# EAGLE schematic supervisor (EAGLE 8.0.0)
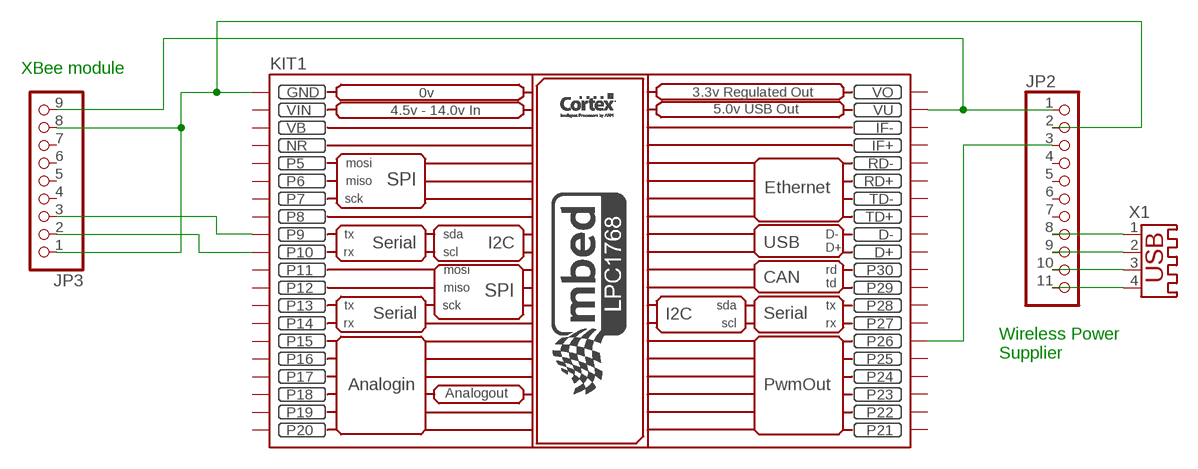
[diagram p0: schematic, sheet 1]

## Parts
JP2  PINHD-1X11  [1X11]
JP3  PINHD-1X9  [1X09]
KIT1  MBED_NXP_LPC1768  [MBED-KIT]
X1  USB-A003  [USB-A003]

## Nets
N$1: JP2.1 JP3.9 KIT1.VU
N$2: JP2.2 JP3.1 JP3.8 KIT1.GND
N$3: JP3.2 KIT1.P$10(P10)
N$4: JP3.3 KIT1.P$9(P9)
N$5: JP2.3 KIT1.P$26(P26)
N$6: JP2.8 X1.1
N$7: JP2.9 X1.2
N$8: JP2.10 X1.3
N$9: JP2.11 X1.4
Unconnected: JP2.4 JP2.5 JP2.6 JP2.7 JP3.4 JP3.5 JP3.6 JP3.7 KIT1.D+ KIT1.D- KIT1.IF+ KIT1.IF- KIT1.P$5(P5) KIT1.P$6(P6) KIT1.P$7(P7) KIT1.P$8(P8) KIT1.P$11(P11) KIT1.P$12(P12) KIT1.P$13(P13) KIT1.P$14(P14) KIT1.P$15(P15) KIT1.P$16(P16) KIT1.P$17(P17) KIT1.P$18(P18) KIT1.P$19(P19) KIT1.P$20(P20) KIT1.P$21(P21) KIT1.P$22(P22) KIT1.P$23(P23) KIT1.P$24(P24) KIT1.P$25(P25) KIT1.P$27(P27) KIT1.P$28(P28) KIT1.P$29(P29) KIT1.P$30(P30) KIT1.RD+ KIT1.RD- KIT1.TD+ KIT1.TD-

## Notes on the sheet
- XBee module
- Wireless Power
  Supplier

## Power pins joined to a net without a drawn wire
NR: KIT1.NR
VB: KIT1.VB
VIN: KIT1.VIN
VO: KIT1.VOUT(VO)

## Library data of the parts
JP2 = pinhead:PINHD-1X11: PIN HEADER
JP3 = pinhead:PINHD-1X9: PIN HEADER
KIT1 = MBED_v2.1:MBED_NXP_LPC1768: Mbed LPC1768 - ARM CORTEX v2.1 * Schematic symbol is now placed in eagles's default raster. *The pads diameter are suitable for routing between mbed pins * mbed pads are 0.8 mm drill diameter. --------------------------------------------- Created by: Mohamed Yousry *Alexandria, Egypt *Email: mohamed.yousry@ieeegoldegypt.org
X1 = con-yamaichi:USB-A003: USB connector; OC_FARNELL: unknown; OC_NEWARK: unknown